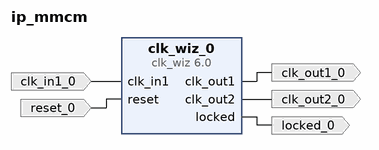
[diagram p0: block diagram of the top level]
# Vivado block design ip_mmcm, xc7z010clg400-1, Vivado 2019.2
create_bd_design ip_mmcm

create_bd_port -dir I -type clk clk_in1_0
set_property -dict {CONFIG.FREQ_HZ 50000000} [get_bd_ports clk_in1_0]
create_bd_port -dir O -type clk clk_out1_0
set_property -dict {CONFIG.FREQ_HZ 16001564} [get_bd_ports clk_out1_0]
create_bd_port -dir O -type clk clk_out2_0
set_property -dict {CONFIG.FREQ_HZ 32772435} [get_bd_ports clk_out2_0]
create_bd_port -dir O locked_0
create_bd_port -dir I -type rst reset_0
set_property -dict {CONFIG.POLARITY ACTIVE_HIGH} [get_bd_ports reset_0]

create_bd_cell -type ip -vlnv xilinx.com:ip:clk_wiz:6.0 clk_wiz_0
set_property -dict [list \
  CONFIG.CLKIN1_JITTER_PS 200.0 \
  CONFIG.CLKOUT1_JITTER 438.358 \
  CONFIG.CLKOUT1_PHASE_ERROR 386.312 \
  CONFIG.CLKOUT1_REQUESTED_OUT_FREQ 16 \
  CONFIG.CLKOUT2_JITTER 383.201 \
  CONFIG.CLKOUT2_PHASE_ERROR 386.312 \
  CONFIG.CLKOUT2_REQUESTED_OUT_FREQ 32.768 \
  CONFIG.CLKOUT2_USED true \
  CONFIG.MMCM_CLKFBOUT_MULT_F 51.125 \
  CONFIG.MMCM_CLKIN1_PERIOD 20.000 \
  CONFIG.MMCM_CLKIN2_PERIOD 10.0 \
  CONFIG.MMCM_CLKOUT0_DIVIDE_F 53.250 \
  CONFIG.MMCM_CLKOUT1_DIVIDE 26 \
  CONFIG.MMCM_DIVCLK_DIVIDE 3 \
  CONFIG.NUM_OUT_CLKS 2 \
  CONFIG.PRIM_IN_FREQ 50.000 \
] [get_bd_cells clk_wiz_0]

# ---- connections ----

connect_bd_net -net clk_in1_0_1 [get_bd_ports clk_in1_0] [get_bd_pins clk_wiz_0/clk_in1]
connect_bd_net [get_bd_pins clk_wiz_0/clk_out1] [get_bd_ports clk_out1_0]
connect_bd_net [get_bd_pins clk_wiz_0/clk_out2] [get_bd_ports clk_out2_0]
connect_bd_net [get_bd_pins clk_wiz_0/locked] [get_bd_ports locked_0]
connect_bd_net -net reset_0_1 [get_bd_ports reset_0] [get_bd_pins clk_wiz_0/reset]

validate_bd_design
save_bd_design
